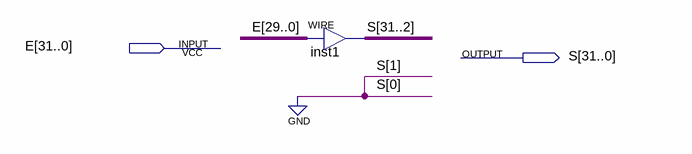
[diagram p0: schematic sheet]
// Quartus schematic 2bit_ShifterL_32.bdf as structural Verilog: 1 symbols, 2 pins
module \2bit_ShifterL_32  (
  input  [31:0] E,
  output [31:0] S
);

  assign S[31:2] = E[29:0];  // WIRE inst1

  assign S[1:0] = 2'b00;
endmodule
